# EAGLE design block_reset (EAGLE 7.7.0)
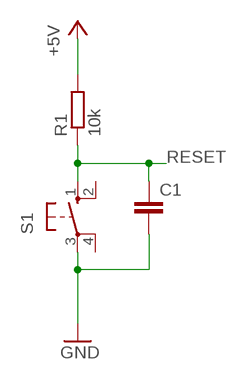
[diagram p0: schematic, sheet 1]

## Parts
C1  C-EU050-024X044  [C050-024X044]
R1  10k  R-EU_0207/10  [0207/10]
S1  10-XX  [B3F-10XX]

## Nets
+5V: R1.2
GND: C1.2 S1.3(P)
RESET: C1.1 R1.1 S1.1(S)
Unconnected: S1.2(S1) S1.4(P1)

## Library data of the parts
C1 = resistor:C-EU: CAPACITOR, European symbol
R1 = resistor:R-EU_: RESISTOR, European symbol
S1 = switch-omron:10-XX: OMRON SWITCH; MPN: B3F-1000; OC_FARNELL: 176432; OC_NEWARK: 36M3542

## Board
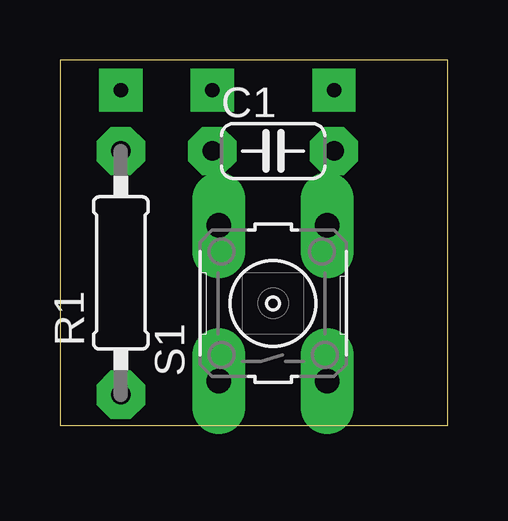
[diagram p1: board, top side]
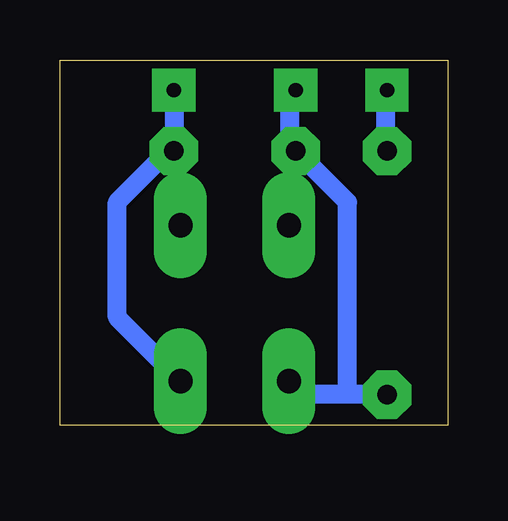
[diagram p2: board, bottom side, seen from below]

Size 16.18 x 15.23 mm. Coordinates in mm from the lower left corner, seen from the top.
Outline: 0,0 16.18,0 16.18,15.23 0,15.23 0,0
Copper layers (1*16): Top 0.035mm / dielectric 1.5mm / Bottom 0.035mm
Design rules "hobby": minimum track width 0.8mm, minimum drill 0.8mm, track to track 0.8mm, track to pad 0.8mm, pad to pad 0.45mm, via to via 0.8mm, smd to smd 8mil, copper to edge 10mil, drill to drill 8mil, minimum pad ring 0.6mm, minimum via ring 0.6mm, stop-mask expansion 0mil, vias tented up to drill 0mil, thermal gap 10mil

### Footprints (pad centres in the part's own frame; a part is rotated, then mirrored left to right if it is on the bottom)
C050-024X044 = drill 0.813 octagon: 1 -2.54,0; 2 2.54,0
0207/10 = drill 0.813 octagon: 1 -5.08,0; 2 5.08,0
B3F-10XX = drill 1.016 long: 1 -3.251,2.261; 2 3.251,2.261; 3 -3.251,-2.261; 4 3.251,-2.261

### Placement (x,y rotation side)
C1  8.89,11.43 0 top
R1  2.54,6.35 90 top
S1  8.89,5.08 90 top

### Tracks (layer width: path | path; a pad name or v marks a point on that pad's centre or on a via)
+5V  (via drill 0.6)
  Bottom 0.8: v2.54,13.97 2.59,13.3 2.59,11.7 R1.2
GND  (via drill 0.6)
  Bottom 0.8: v11.43,13.97 11.39,13.3 11.39,11.7 C1.2 12.19,10.9 13.79,9.3 13.79,4.5 11.39,2.1 S1.3
RESET  (via drill 0.6)
  Bottom 0.8: v6.35,13.97 6.59,13.3 6.59,11.7 C1.1 5.79,10.9 4.19,9.3 4.19,1.3 | 4.19,1.3 6.59,1.3 S1.1 | 4.19,1.3 2.59,1.3 R1.1